# EAGLE design Projet (EAGLE 9.4.2)
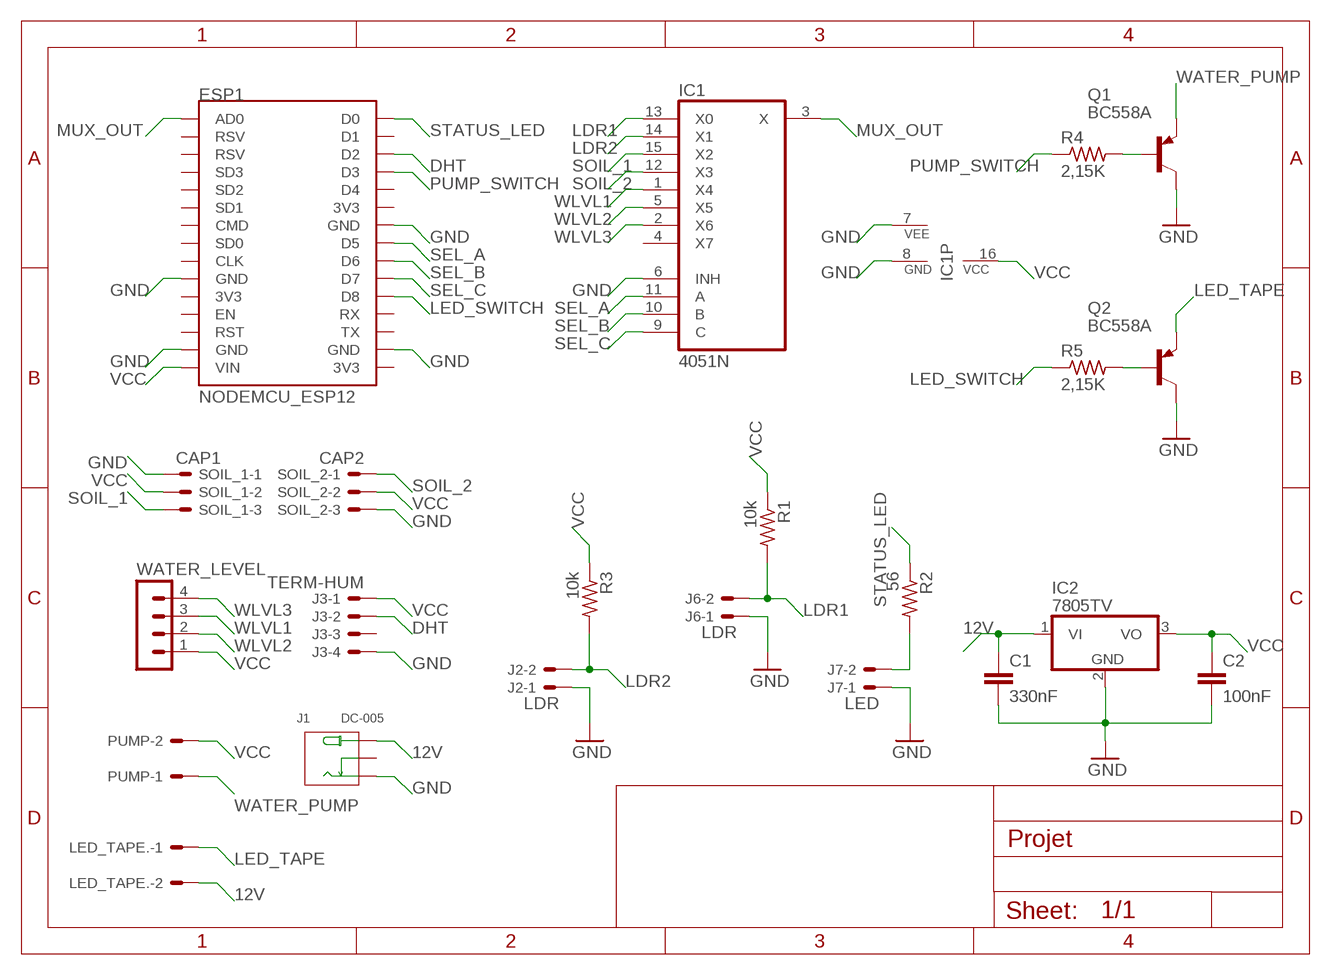
[diagram p0: schematic, sheet 1]

## Parts
C1  330nF  CAP_CERAMICO  [CAP_CERAMICO]
C2  100nF  CAP_CERAMICO  [CAP_CERAMICO]
ESP1  NODEMCU_ESP12  [NODEMCU_ESP12]
IC1  4051N  [DIL16]
IC2  7805TV  [TO220V]
J1  DC-005  CONN-POWER-JACK-2.1MM(DC-005)  [DCJ3P-14.2X11.0X9.0MM]
J2  LDR  22-05-7028-02  [7395-02]
J3  TERM-HUM  22-05-7048-04  [7395-04]
J6  LDR  22-05-7028-02  [7395-02]
J7  LED  22-05-7028-02  [7395-02]
LED_TAPE.  KK-156-2  [KK-156-2]
PUMP  KK-156-2  [KK-156-2]
Q1  BC558A  [TO92-EBC]
Q2  BC558A  [TO92-EBC]
R1  10k  R-US_0204/7  [0204/7]
R2  56  R-US_0204/7  [0204/7]
R3  10k  R-US_0204/7  [0204/7]
R4  2,15K  R-US_0204/7  [0204/7]
R5  2,15K  R-US_0204/7  [0204/7]
SOIL_1  CAP1  22-05-7038-03  [7395-03]
SOIL_2  CAP2  22-05-7038-03  [7395-03]
WATER_LEVEL  MA04-1  [MA04-1]

## Nets
12V: C1.P$1 IC2.1(VI) J1.+ LED_TAPE..2
DHT: ESP1.D2 J3.2
GND: C1.P$2 C2.P$2 ESP1.GND@0(GND) ESP1.GND@1(GND) ESP1.GND@2(GND) ESP1.GND@3(GND) IC1.6(INH) IC1.7(VEE) IC1.8(GND) IC2.2(GND) J1.-1(-) J2.1 J3.4 J6.1 J7.1 Q1.C Q2.C SOIL_1.1 SOIL_2.3
LDR1: IC1.13(X0) J6.2 R1.2
LDR2: IC1.14(X1) J2.2 R3.2
LED_SWITCH: ESP1.D8 R5.1
LED_TAPE: LED_TAPE..1 Q2.E
MUX_OUT: ESP1.AD0 IC1.3(X)
N$1: J7.2 R2.2
N$4: Q1.B R4.2
N$5: Q2.B R5.2
PUMP_SWITCH: ESP1.D3 R4.1
SEL_A: ESP1.D5 IC1.11(A)
SEL_B: ESP1.D6 IC1.10(B)
SEL_C: ESP1.D7 IC1.9(C)
SOIL_1: IC1.15(X2) SOIL_1.3
SOIL_2: IC1.12(X3) SOIL_2.1
STATUS_LED: ESP1.D0 R2.1
VCC: C2.P$1 ESP1.VIN IC1.16(VCC) IC2.3(VO) J3.1 PUMP.2 R1.1 R3.1 SOIL_1.2 SOIL_2.2 WATER_LEVEL.1
WATER_PUMP: PUMP.1 Q1.E
WLVL1: IC1.1(X4) WATER_LEVEL.3
WLVL2: IC1.5(X5) WATER_LEVEL.2
WLVL3: IC1.2(X6) WATER_LEVEL.4
Unconnected: ESP1.3V3@0(3V3) ESP1.3V3@1(3V3) ESP1.3V3@2(3V3) ESP1.CLK ESP1.CMD ESP1.D1 ESP1.D4 ESP1.EN ESP1.RST ESP1.RSV@0(RSV) ESP1.RSV@1(RSV) ESP1.RX ESP1.SD0 ESP1.SD1 ESP1.SD2 ESP1.SD3 ESP1.TX IC1.4(X7) J1.-2(CDN) J3.3

## Library data of the parts
C1 C2 = thiago_componentes:CAP_CERAMICO
ESP1 = thiago_componentes:NODEMCU_ESP12
IC1 = 40xx:4051: 8-channel ANALOG MULTIPLEXER
IC2 = linear:78*: Positive VOLTAGE REGULATOR Source: http://cache.national.com/ds/LM/LM78L05.pdf http://www.fairchildsemi.com/ds/LM/LM7805.pdf
J1 = Seeed-OPL-Connector:CONN-POWER-JACK-2.1MM(DC-005): 320120003; MPN: DC-005
J2 J6 J7 = con-molex:22-?-02: CONNECTOR wire to board 2.54 mm (.1 inch) pitch header; OC_FARNELL: 9731601; OC_NEWARK: unknown
J3 = con-molex:22-?-04: CONNECTOR wire to board 2.54 mm (.1 inch) pitch header; OC_FARNELL: unknown; OC_NEWARK: unknown
LED_TAPE. PUMP = con-molex:KK-156-2: KK 156 HEADER Source: http://www.molex.com/pdm_docs/sd/026604100_sd.pdf; OC_FARNELL: unknown; OC_NEWARK: unknown
Q1 Q2 = transistor-pnp:BC558*: PNP Transistror
R1-R5 = adafruit:R-US_: RESISTOR, American symbol
SOIL_1 SOIL_2 = con-molex:22-?-03: CONNECTOR wire to board 2.54 mm (.1 inch) pitch header; OC_FARNELL: unknown; OC_NEWARK: unknown
WATER_LEVEL = con-lstb:MA04-1: PIN HEADER; OC_FARNELL: unknown; OC_NEWARK: unknown

## Board
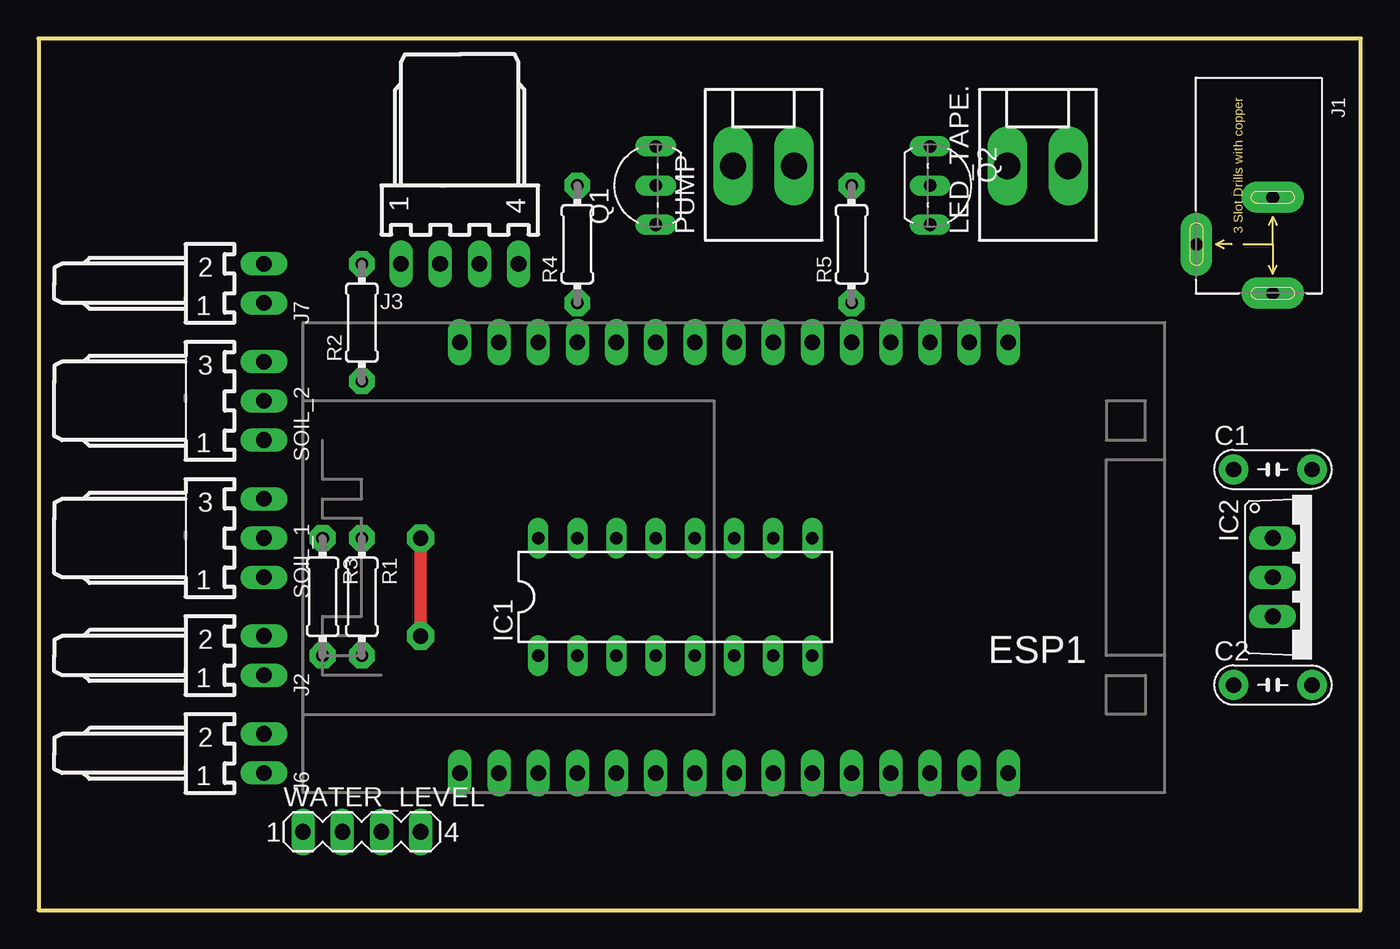
[diagram p1: board, top side]
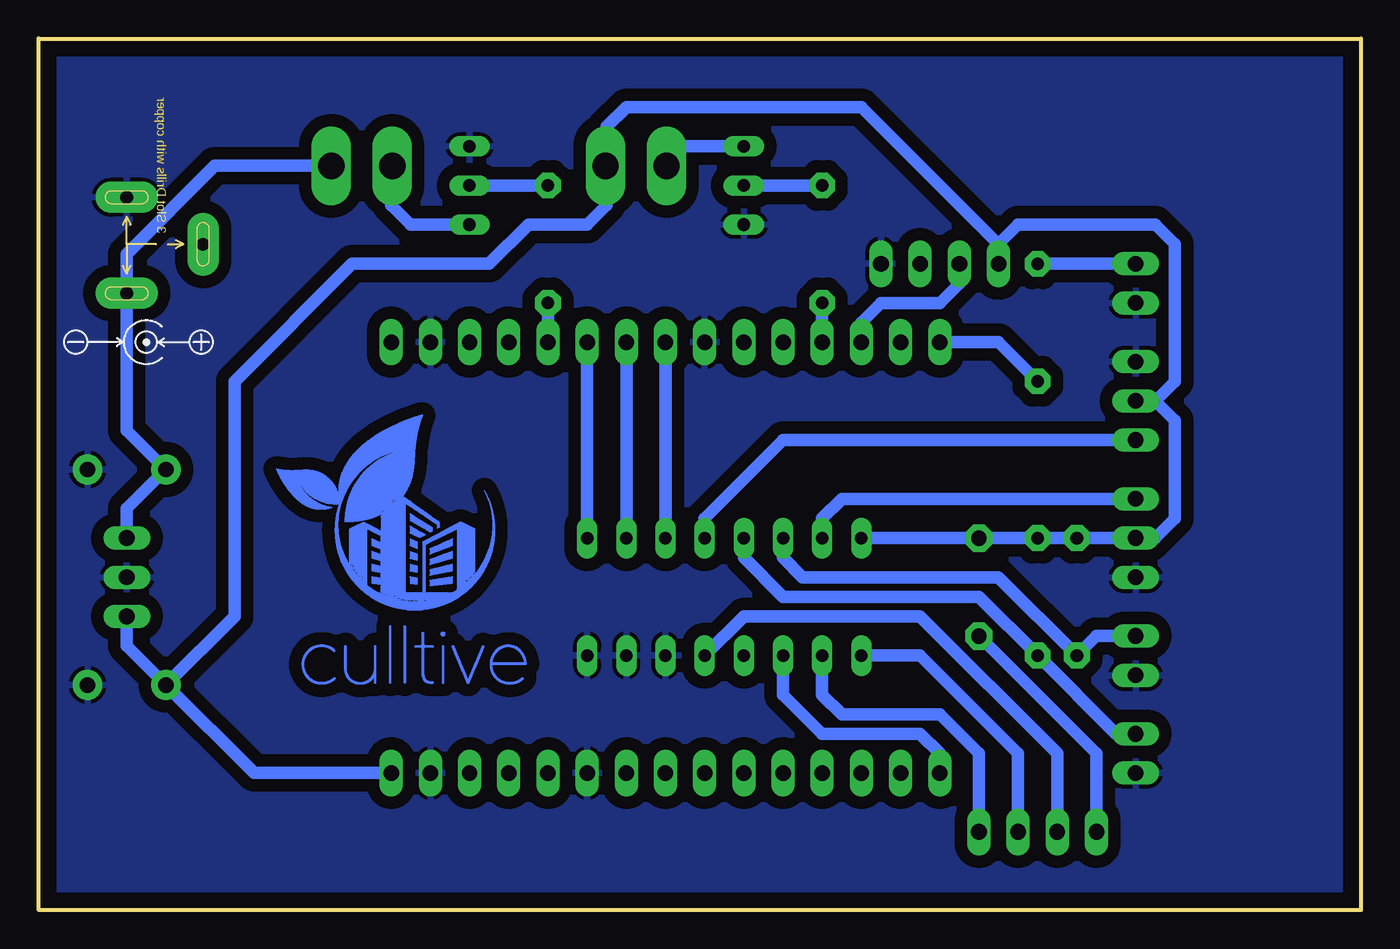
[diagram p2: board, bottom side, seen from below]

Size 85.72 x 56.52 mm. Coordinates in mm from the lower left corner, seen from the top.
Outline: 0,0 85.7,0 85.72,56.52 0,56.52 0,0
Copper layers (1*16): Top 0.035mm / dielectric 1.5mm / Bottom 0.035mm
Design rules "default": minimum track width 10mil, minimum drill 24mil, track to track 8mil, track to pad 8mil, pad to pad 8mil, via to via 8mil, smd to smd 8mil, copper to edge 40mil, drill to drill 8mil, minimum pad ring 10mil, minimum via ring 8mil, stop-mask expansion 4mil, vias tented up to drill 0mil, thermal gap 10mil

### Footprints (pad centres in the part's own frame; a part is rotated, then mirrored left to right if it is on the bottom)
CAP_CERAMICO = drill 1 pad 1.93: P$1 -2.54,0; P$2 2.54,0
NODEMCU_ESP12 = drill 1 long: 3V3@0 -13.97,-8.89; 3V3@1 13.97,3.81; 3V3@2 13.97,-19.05; AD0 -13.97,16.51; CLK -13.97,-3.81; CMD -13.97,1.27; D0 13.97,16.51; D1 13.97,13.97; D2 13.97,11.43; D3 13.97,8.89; D4 13.97,6.35; D5 13.97,-1.27; D6 13.97,-3.81; D7 13.97,-6.35; D8 13.97,-8.89; EN -13.97,-11.43; GND@0 -13.97,-6.35; GND@1 -13.97,-16.51; GND@2 13.97,1.27; GND@3 13.97,-16.51; RST -13.97,-13.97; RSV@0 -13.97,13.97; RSV@1 -13.97,11.43; RX 13.97,-11.43; SD0 -13.97,-1.27; SD1 -13.97,3.81; SD2 -13.97,6.35; SD3 -13.97,8.89; TX 13.97,-13.97; VIN -13.97,-19.05
DIL16 = drill 0.813 long: 1 -8.89,-3.81; 2 -6.35,-3.81; 3 -3.81,-3.81; 4 -1.27,-3.81; 5 1.27,-3.81; 6 3.81,-3.81; 7 6.35,-3.81; 8 8.89,-3.81; 9 8.89,3.81; 10 6.35,3.81; 11 3.81,3.81; 12 1.27,3.81; 13 -1.27,3.81; 14 -3.81,3.81; 15 -6.35,3.81; 16 -8.89,3.81
TO220V = drill 1.016 long: 1 -2.54,-2.54; 2 0,-2.54; 3 2.54,-2.54
DCJ3P-14.2X11.0X9.0MM = drill 0.813 pad 2.032 long: + 3.175,0; -1 -3.048,0; -2 0,-4.953
7395-02 = drill 1.016 long: 1 1.27,0; 2 -1.27,0
7395-04 = drill 1.016 long: 1 3.81,0; 2 1.27,0; 3 -1.27,0; 4 -3.81,0
KK-156-2 = drill 1.7 pad 2.184 long: 1 -1.98,0; 2 1.98,0
TO92-EBC = drill 0.813 long: B 0,-1.27; C -2.54,-1.27; E 2.54,-1.27
0204/7 = drill 0.813 pad 1.676 octagon: 1 -3.81,0; 2 3.81,0
7395-03 = drill 1.016 long: 1 2.54,0; 2 0,0; 3 -2.54,0
MA04-1 = drill 1.016 long: 1 -3.81,0; 2 -1.27,0; 3 1.27,0; 4 3.81,0

### Placement (x,y rotation side)
C1  80.01,28.58 0 top
C2  80.01,14.61 0 top
ESP1  43.81,22.86 90 top
IC1  41.27,20.32 0 top
IC2  82.55,21.59 270 top
J1  80.01,43.18 270 top
J2  14.6,16.51 270 top
J3  27.3,41.91 180 top
J6  14.6,10.16 270 top
J7  14.6,40.64 270 top
LED_TAPE.  64.77,48.26 0 top
PUMP  46.99,48.26 0 top
Q1  38.73,46.99 90 top
Q2  59.05,46.99 270 top
R1  20.95,20.32 270 top
R2  20.95,38.1 90 top
R3  18.41,20.32 270 top
R4  34.92,43.18 90 top
R5  52.7,43.18 90 top
SOIL_1  14.6,24.13 270 top
SOIL_2  14.6,33.02 270 top
WATER_LEVEL  20.95,5.08 0 top

### Tracks (layer width: path | path; a pad name or v marks a point on that pad's centre or on a via)
12V
  Bottom 0.813: LED_TAPE..2 74.29,48.26 80.01,42.55 J1.+ 80.01,31.12 C1.P$1 80.01,26.04 IC2.1
DHT
  Bottom 0.813: J3.2 26.03,40.64 27.3,39.37 31.11,39.37 32.38,38.1 ESP1.D2
GND
  pour Bottom (isolate 0.813): 0,0 86.99,0 85.72,56.52 0,56.52
LDR1
  Bottom 0.813: IC1.13 40,22.86 37.46,20.32 24.76,20.32 R1.2 15.88,11.43 J6.2
LDR2
  Bottom 0.813: IC1.14 37.46,22.86 36.19,21.59 23.49,21.59 R3.2 17.14,17.78 J2.2
LED_SWITCH
  Bottom 0.813: ESP1.D8 R5.1
LED_TAPE
  Bottom 0.813: Q2.E 61.59,44.45 62.86,45.72 62.86,48.19 LED_TAPE..1
MUX_OUT
  Bottom 0.813: ESP1.AD0 27.3,10.16 28.57,11.43 34.92,11.43 37.46,13.97 IC1.3
N$1
  Bottom 0.813: R2.2 J7.2
N$4
  Bottom 0.813: Q1.B R4.2
N$5
  Bottom 0.813: Q2.B R5.2
PUMP_SWITCH
  Bottom 0.813: ESP1.D3 R4.1
SEL_A
  Bottom 0.813: IC1.11 ESP1.D5
SEL_B
  Bottom 0.813: IC1.10 ESP1.D6
SEL_C
  Bottom 0.813: IC1.9 ESP1.D7
SOIL_1
  Bottom 0.813: SOIL_1.3 33.65,26.67 34.92,25.4 IC1.15
SOIL_2
  Bottom 0.813: SOIL_2.1 37.46,30.48 42.54,25.4 IC1.12
STATUS_LED
  Bottom 0.813: ESP1.D0 23.49,36.83 R2.1
VCC  (via drill 1 pad 1.78)
  Top 0.813: v24.76,17.78 v24.76,24.13
  Bottom 0.813: IC1.16 v24.76,24.13 R1.1 R3.1 SOIL_1.2 13.33,24.13 12.06,25.4 12.06,31.75 13.33,33.02 | WATER_LEVEL.1 17.14,10.16 v24.76,17.78 | J3.1 23.49,43.18 | SOIL_2.2 13.33,33.02 | 13.33,33.02 12.06,34.29 12.06,43.18 13.33,44.45 22.22,44.45 23.49,43.18 | 23.49,43.18 32.38,52.07 47.62,52.07 48.89,50.8 48.89,48.34 PUMP.2 48.89,48.19 48.89,45.72 50.16,44.45 53.97,44.45 56.51,41.91 65.41,41.91 73.02,34.29 73.02,19.05 C2.P$1 | IC2.3 80.01,17.15 C2.P$1 | ESP1.VIN 71.75,8.89 C2.P$1
WATER_PUMP
  Bottom 0.813: PUMP.1 45.01,48.34 43.81,49.53 Q1.E
WLVL1
  Bottom 0.813: WATER_LEVEL.3 22.22,10.16 28.57,16.51 IC1.1
WLVL2
  Bottom 0.813: WATER_LEVEL.2 19.68,10.16 28.57,19.05 40,19.05 IC1.5
WLVL3
  Bottom 0.813: WATER_LEVEL.4 24.76,10.16 27.3,12.7 33.65,12.7 34.92,13.97 IC1.2
(copper drawn outside any net)
  shapes: Bottom area x7728